# EAGLE schematic first (EAGLE 6.1)
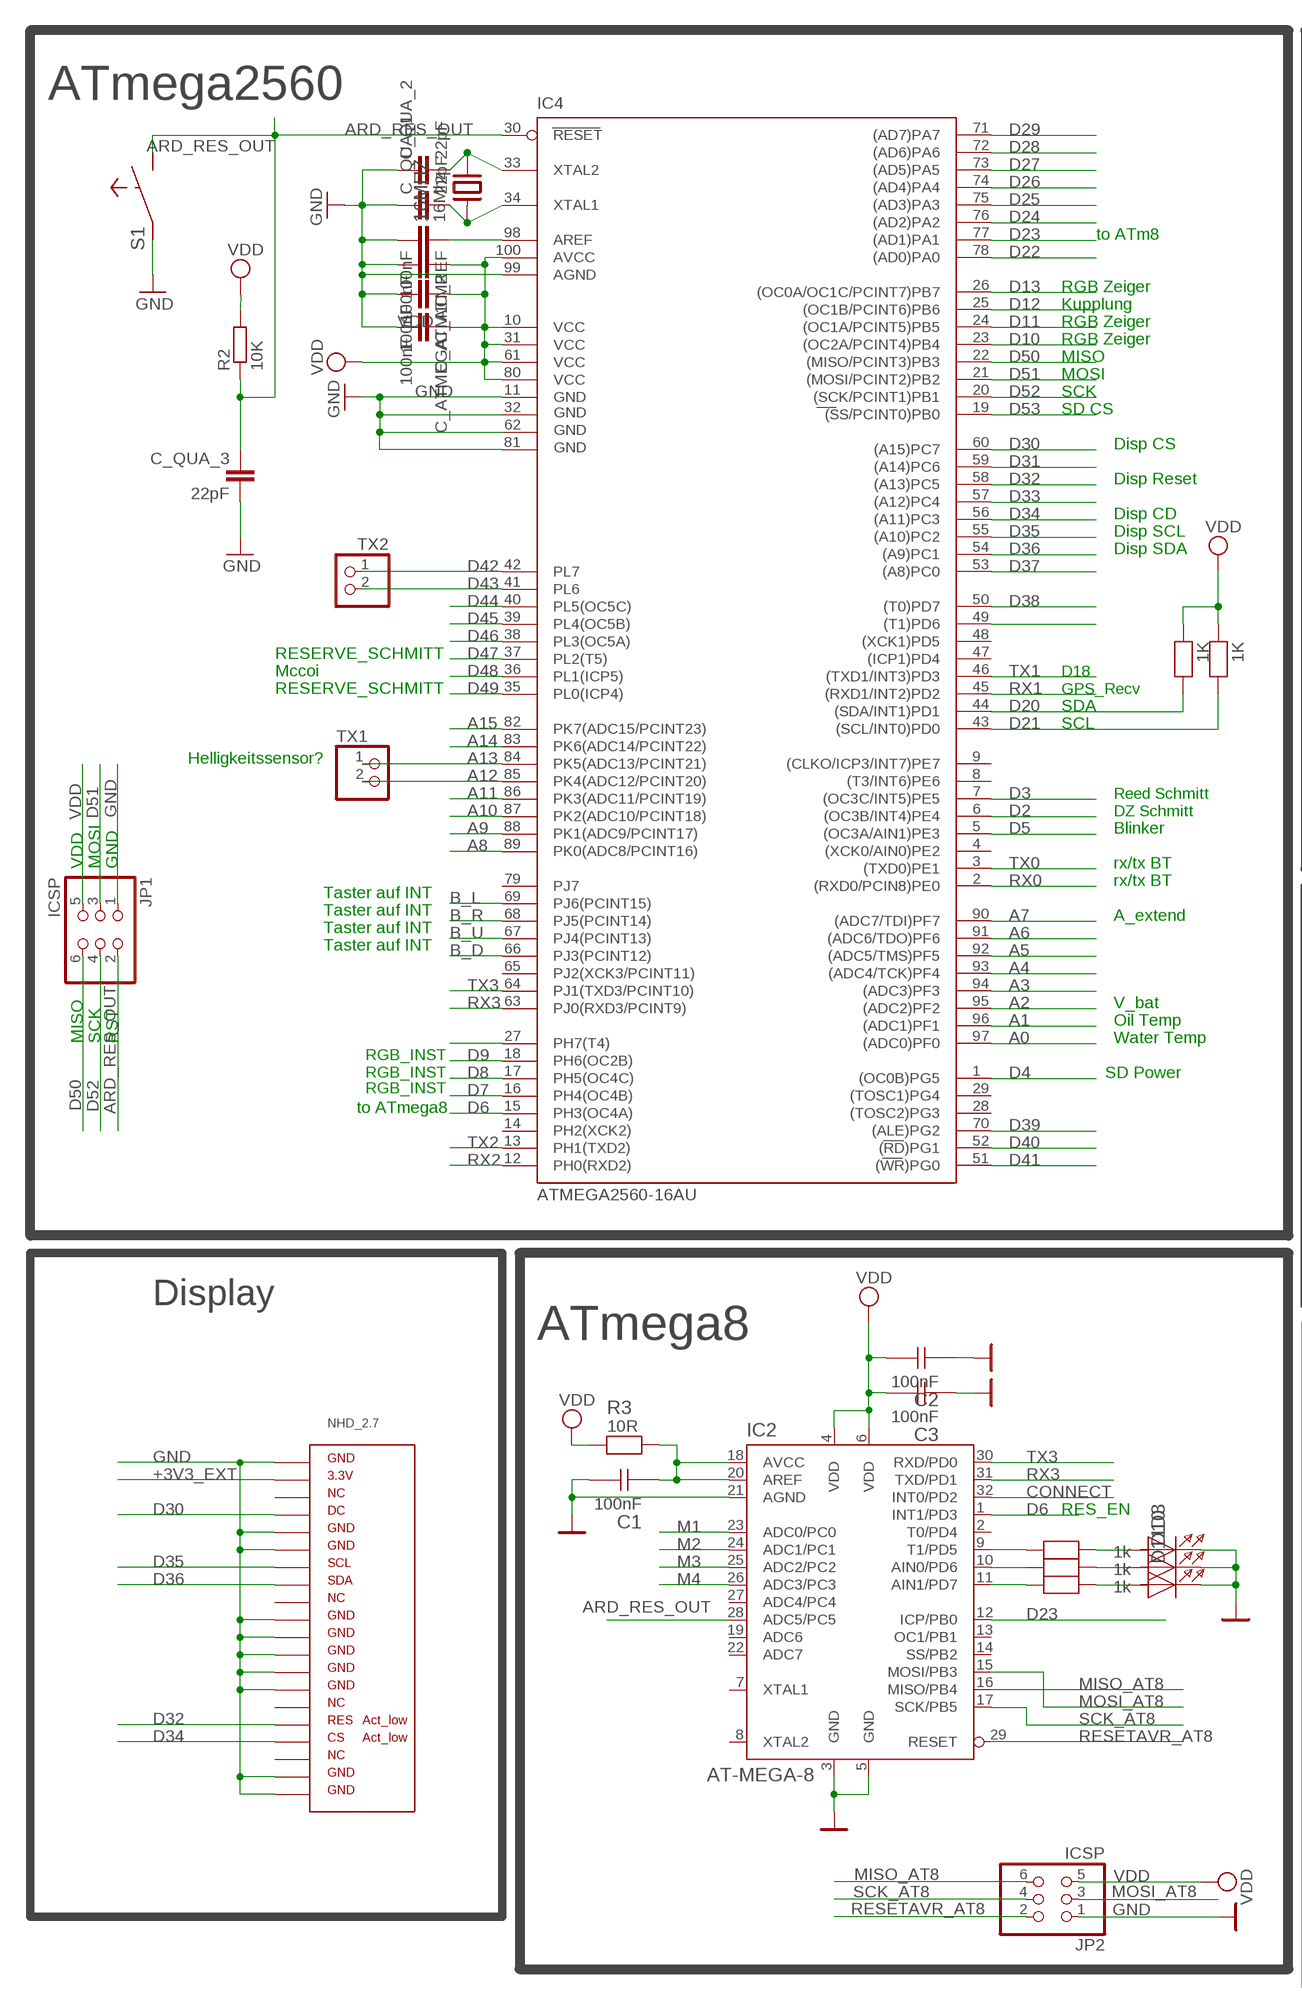
[diagram p0: schematic, sheet 1, part 1 of 2]
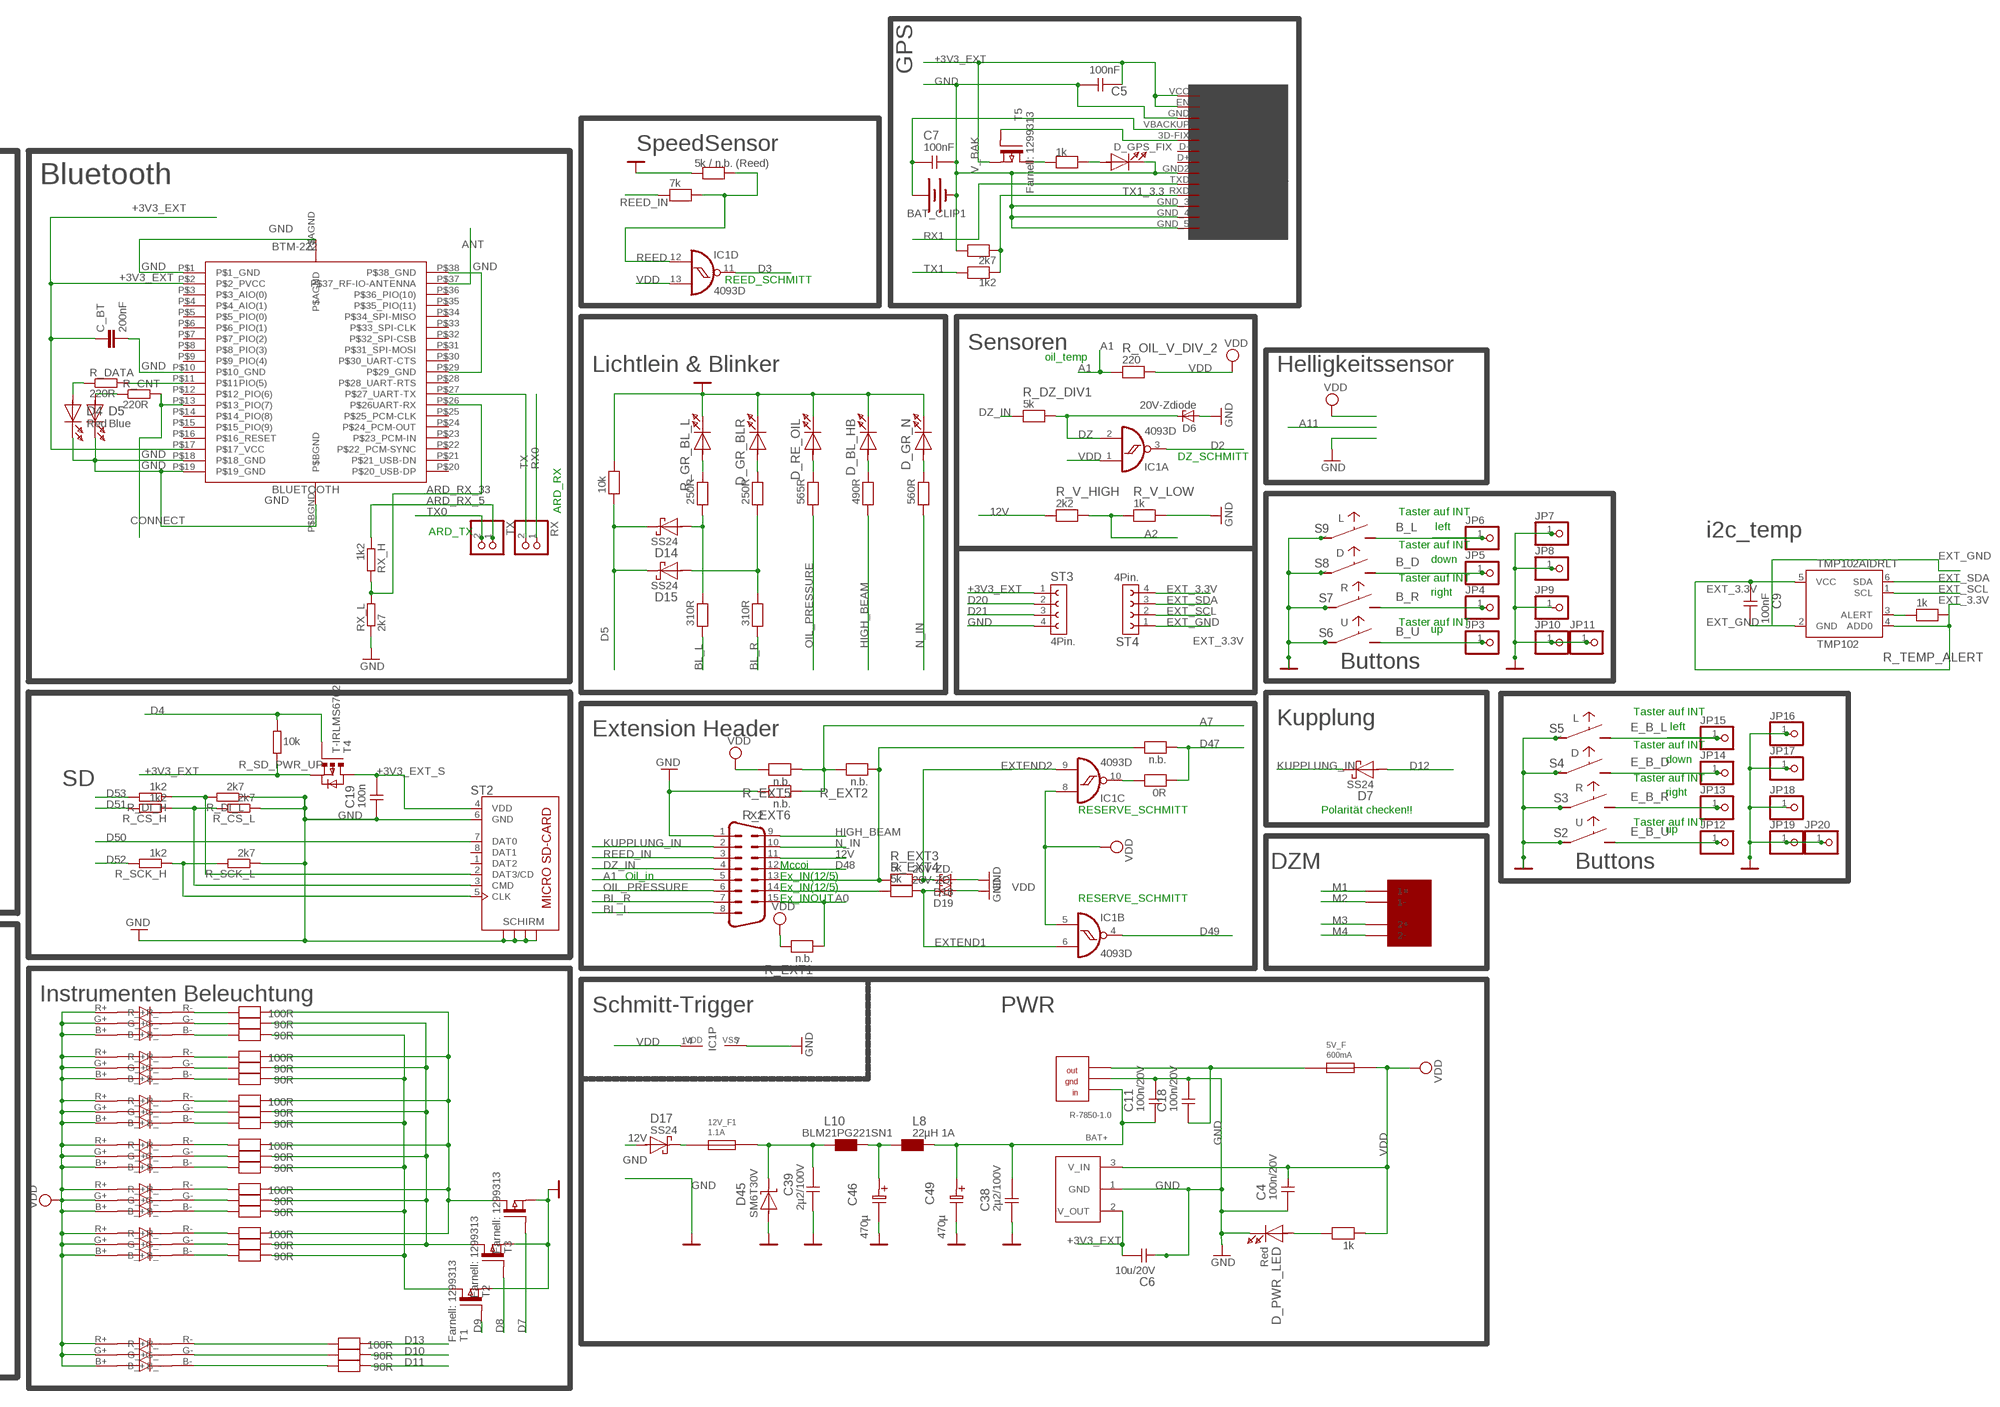
[diagram p1: schematic, sheet 1, part 2 of 2]

## Parts
5V_F  600mA  POLY_FUSE  [POLY_FUSE]
12V_F1  1.1A  POLY_FUSE  [POLY_FUSE]
16MHZ  16Mhz  XT-HC49-SMD  [XT-HC49S-SMD]
18632422  RGB_LED  [RGB_LED]
BAT_CLIP1  F_908642  BATTERY12MM  [BATTCON_12MM]
BLUETOOTH  BTM-222  [BTM-222]
C1  100nF  C0805  [0805]
C2  100nF  C0805  [0805]
C3  100nF  C0805  [0805]
C4  100n/20V  C0805  [0805]
C5  100nF  C0805  [0805]
C6  10u/20V  C0805  [0805]
C7  100nF  C0805  [0805]
C9  100nF  C0805  [0805]
C11  100n/20V  C0805  [0805]
C18  100n/20V  C0805  [0805]
C19  100n  C0805  [0805]
C38  2µ2/100V  C0805  [0805]
C39  2µ2/100V  C0805  [0805]
C46  470µ  C-ELKO-5-8X13R  [EL-5-8X13R]
C49  470µ  C-ELKO-5-8X13  [EL-5-8X13]
C_ATM1  100nF  C-EUC0805  [C0805]
C_ATM2  100nF  C-EUC0805  [C0805]
C_ATMEGA  100nF  C-EUC0805  [C0805]
C_BT  200nF  C-EUC0805  [C0805]
C_QUA_1  22pF  C-EUC0805  [C0805]
C_QUA_2  22pF  C-EUC0805  [C0805]
C_QUA_3  22pF  C-EUC0805  [C0805]
C_REF  100nF  C-EUC0805  [C0805]
D3  LED0805  [LED-0805]
D4  Red  LED0805  [LED-0805]
D5  Blue  LED0805  [LED-0805]
D6  20V-Zdiode  ZENER-DIODESMB  [SMB]
D7  SS24  D-SSMB-A+K  [SMB]
D10  LED0805  [LED-0805]
D11  LED0805  [LED-0805]
D14  SS24  D-SSMB-A+K  [SMB]
D15  SS24  D-SSMB-A+K  [SMB]
D17  SS24  D-SSMB-A+K  [SMB]
D18  20V-ZD.  ZENER-DIODESMB  [SMB]
D19  20V-ZD.  ZENER-DIODESMB  [SMB]
D45  SM6T30V  D-TD  [SMB]
D_BL_HB  HighB _ 645-598-8191-107F  LED0805  [LED-0805]
D_GPS_FIX  Red  LED0805  [LED-0805]
D_GR_BLR  BL_R  LED0805  [LED-0805]
D_GR_N  N _ M 645-598-8110-107F  LED0805  [LED-0805]
D_PWR_LED  Red  LED0805  [LED-0805]
D_RE_OIL  OIL M 645-598-8110-107F  LED0805  [LED-0805]
DCDC53.3  AP1117E33G  [SOT223]
GPS  MT3329  [MT3329]
IC1  4093D  [SO14]
IC2  AT-MEGA-8  [TQFP-32_7X7]
IC4  ATMEGA2560-16AU  [TQFP100]
JP1  ICSP  PINHD-2X3  [2X03]
JP2  ICSP  PINHD-2X3  [2X03]
JP3  PINHD-1X1  [1X01]
JP4  PINHD-1X1  [1X01]
JP5  PINHD-1X1  [1X01]
JP6  PINHD-1X1  [1X01]
JP7  PINHD-1X1  [1X01]
JP8  PINHD-1X1  [1X01]
JP9  PINHD-1X1  [1X01]
JP10  PINHD-1X1  [1X01]
JP11  PINHD-1X1  [1X01]
JP12  PINHD-1X1  [1X01]
JP13  PINHD-1X1  [1X01]
JP14  PINHD-1X1  [1X01]
JP15  PINHD-1X1  [1X01]
JP16  PINHD-1X1  [1X01]
JP17  PINHD-1X1  [1X01]
JP18  PINHD-1X1  [1X01]
JP19  PINHD-1X1  [1X01]
JP20  PINHD-1X1  [1X01]
L8  22µH 1A  LPD54  [L-PD54]
L10  BLM21PG221SN1  L0808+0603  [0805+603]
NHD_2.7  NHD_2.7_SOLO_RO  [NHD_2.7_SOLO_RO]
PWR_R78  R-7805-1.0  [SIP3]
R1  250R  R0805  [0805]
R2  10K  R-EU_R0805  [R0805]
R3  10R  R0805  [0805]
R4  250R  R0805  [0805]
R5  565R  R0805  [0805]
R6  490R  R0805  [0805]
R7  310R  R0805  [0805]
R8  310R  R0805  [0805]
R9  10k  R0805  [0805]
R10  5k / n.b. (Reed)  R0805  [0805]
R11  7k  R0805  [0805]
R12  100R  R0805  [0805]
R13  90R  R0805  [0805]
R14  90R  R0805  [0805]
R15  1k  R0805  [0805]
R16  1k  R0805  [0805]
R17  1k  R0805  [0805]
R18  100R  R0805  [0805]
R19  90R  R0805  [0805]
R20  90R  R0805  [0805]
R21  100R  R0805  [0805]
R22  90R  R0805  [0805]
R23  90R  R0805  [0805]
R24  100R  R0805  [0805]
R25  90R  R0805  [0805]
R26  90R  R0805  [0805]
R27  560R  R0805  [0805]
R28  1k  R0805  [0805]
R29  100R  R0805  [0805]
R30  90R  R0805  [0805]
R31  90R  R0805  [0805]
R32  100R  R0805  [0805]
R33  90R  R0805  [0805]
R34  90R  R0805  [0805]
R35  100R  R0805  [0805]
R36  90R  R0805  [0805]
R37  90R  R0805  [0805]
R38  0R  R0805  [0805]
R39  n.b.  R0805  [0805]
R40  2k7  R0805  [0805]
R41  1k2  R0805  [0805]
R_CNT  220R  R-EU_M0805  [M0805]
R_CS_H  1k2  R-EU_M0805  [M0805]
R_CS_L  2k7  R-EU_M0805  [M0805]
R_DATA  220R  R-EU_M0805  [M0805]
R_DI_H  1k2  R-EU_M0805  [M0805]
R_DI_L  2k7  R-EU_M0805  [M0805]
R_DZ_DIV1  5k  R0805  [0805]
R_EXT1  n.b.  R0805  [0805]
R_EXT2  n.b.  R0805  [0805]
R_EXT3  5k  R0805  [0805]
R_EXT4  5k  R0805  [0805]
R_EXT5  n.b.  R0805  [0805]
R_EXT6  n.b.  R0805  [0805]
R_GR_BL_L  BL_L  LED0805  [LED-0805]
R_LED_5V  1k  R0805  [0805]
R_OIL_V_DIV_2  220  R0805  [0805]
R_SCK_H  1k2  R-EU_M0805  [M0805]
R_SCK_L  2k7  R-EU_M0805  [M0805]
R_SCL_UP  1K  R0805  [0805]
R_SD_PWR_UP  10k  R-EU_M0805  [M0805]
R_SDA_UP  1K  R0805  [0805]
R_TEMP_ALERT  1k  R0805  [0805]
R_V_HIGH  2k2  R0805  [0805]
R_V_LOW  1k  R0805  [0805]
RX  PINHD-1X2  [1X02]
RX_H  1k2  R-EU_M0805  [M0805]
RX_L  2k7  R-EU_M0805  [M0805]
S1  SW-TASTERECO-DIAGONAL  [SW-ECO]
S2  U  SW-TASTERECO-DIAGONAL  [SW-ECO]
S3  R  SW-TASTERECO-DIAGONAL  [SW-ECO]
S4  D  SW-TASTERECO-DIAGONAL  [SW-ECO]
S5  L  SW-TASTERECO-DIAGONAL  [SW-ECO]
S6  U  SW-TASTERECO-DIAGONAL  [SW-ECO]
S7  R  SW-TASTERECO-DIAGONAL  [SW-ECO]
S8  D  SW-TASTERECO-DIAGONAL  [SW-ECO]
S9  L  SW-TASTERECO-DIAGONAL  [SW-ECO]
ST2  SD_MICRO  [SD_MICRO]
ST3  BU_1X4_BL17-SMD  [BL17SMD_1X4]
ST4  BU_1X4_BL17-SMD  [BL17SMD_1X4]
T1  Farnell: 1299313  T-P-FETBSS139  [SOT-23]
T2  Farnell: 1299313  T-P-FETBSS139  [SOT-23]
T3  Farnell: 1299313  T-P-FETBSS139  [SOT-23]
T4  T-IRLMS6702  [SOT-23-6]
T5  Farnell: 1299313  T-P-FETBSS139  [SOT-23]
TMP102AIDRLT  TMP102  [SOT563]
TX  PINHD-1X2  [1X02]
TX1  PINHD-1X2  [1X02]
TX2  PINHD-1X2  [1X02]
U$3  STEPPER  [STEPPER]
U$14  RGB_LED  [RGB_LED]
U$15  RGB_LED  [RGB_LED]
U$16  RGB_LED  [RGB_LED]
U$18  RGB_LED  [RGB_LED]
U$19  RGB_LED  [RGB_LED]
U$20  RGB_LED  [RGB_LED]
X2  SUB-D-IP67  [IP67-SUB-D]

## Nets
12V: D17.A R_V_HIGH.1 X2.11
12V_SAFE: 12V_F1.P$2 C39.1 D45.K L10.1
+3V3_EXT: BLUETOOTH.P$2(P$2_PVCC) BLUETOOTH.P$17(P$17_VCC) C5.2 C6.2 C_BT.1 DCDC53.3.2(V_OUT) GPS.EN GPS.VCC NHD_2.7.VDD0(VDD) R_SD_PWR_UP.2 ST3.1 T4.4(S) T5.2(S)
+3V3_EXT_S: C19.2 ST2.4(VDD) T4.1(D1) T4.2(D2) T4.5(D3) T4.6(D4)
A0: IC4.97((ADC0)PF0) R_EXT1.1 X2.15
A1: IC4.96((ADC1)PF1) R_OIL_V_DIV_2.1 X2.5
A2: IC4.95((ADC2)PF2) R_V_HIGH.2 R_V_LOW.1
A3: IC4.94((ADC3)PF3)
A4: IC4.93((ADC4/TCK)PF4)
A5: IC4.92((ADC5/TMS)PF5)
A6: IC4.91((ADC6/TDO)PF6)
A7: IC4.90((ADC7/TDI)PF7) R_EXT2.2 R_EXT5.1 R_EXT6.1
A8: IC4.89(PK0(ADC8/PCINT16))
A9: IC4.88(PK1(ADC9/PCINT17))
A10: IC4.87(PK2(ADC10/PCINT18))
A11: IC4.86(PK3(ADC11/PCINT19))
A12: IC4.85(PK4(ADC12/PCINT20)) TX1.2
A13: IC4.84(PK5(ADC13/PCINT21)) TX1.1
A14: IC4.83(PK6(ADC14/PCINT22))
A15: IC4.82(PK7(ADC15/PCINT23))
ANT: BLUETOOTH.P$37(P$37_RF-IO-ANTENNA)
ARD_RES_OUT: C_QUA_3.1 IC2.28(ADC5/PC5) IC4.30(RESET) JP1.2 R2.1 S1.4
ARD_RX_5: RX_H.1 TX.1
ARD_RX_33: BLUETOOTH.P$26(P$26UART-RX) RX_H.2 RX_L.2
B_D: IC4.66(PJ3(PCINT12)) JP5.1 S8.4
B_L: IC4.69(PJ6(PCINT15)) JP6.1 S9.4
B_R: IC4.68(PJ5(PCINT14)) JP4.1 S7.4
B_U: IC4.67(PJ4(PCINT13)) JP3.1 S6.4
BAT+: C11.1 C38.2 C49.1 L8.2 PWR_R78.IN
BL_L: R8.1 X2.8
BL_R: R7.1 X2.7
BLUE_INSTR: R14.2 R20.2 R23.2 R31.2 R34.2 R37.2 T1.3(D)
CONNECT: BLUETOOTH.P$13(P$13_PIO(7)) IC2.32(INT0/PD2) R_CNT.2
D2: IC1.3(A:O) IC4.6((OC3B/INT4)PE4)
D3: IC1.11(D:O) IC4.7((OC3C/INT5)PE5)
D4: IC4.1((OC0B)PG5) R_SD_PWR_UP.1 T4.3(G)
D5: D14.K D15.K IC4.5((OC3A/AIN1)PE3) R9.2
D6: IC2.1(INT1/PD3) IC4.15(PH3(OC4A))
D7: IC4.16(PH4(OC4B)) T3.1(G)
D8: IC4.17(PH5(OC4C)) T2.1(G)
D9: IC4.18(PH6(OC2B)) T1.1(G)
D10: IC4.23((OC2A/PCINT4)PB4) R25.2
D11: IC4.24((OC1A/PCINT5)PB5) R26.2
D12: D7.A IC4.25((OC1B/PCINT6)PB6)
D13: IC4.26((OC0A/OC1C/PCINT7)PB7) R24.2
D20: IC4.44((SDA/INT1)PD1) R_SDA_UP.2 ST3.2
D21: IC4.43((SCL/INT0)PD0) R_SCL_UP.2 ST3.3
D22: IC4.78((AD0)PA0)
D23: IC2.12(ICP/PB0) IC4.77((AD1)PA1)
D24: IC4.76((AD2)PA2)
D25: IC4.75((AD3)PA3)
D26: IC4.74((AD4)PA4)
D27: IC4.73((AD5)PA5)
D28: IC4.72((AD6)PA6)
D29: IC4.71((AD7)PA7)
D30: IC4.60((A15)PC7) NHD_2.7.DC
D31: IC4.59((A14)PC6)
D32: IC4.58((A13)PC5) NHD_2.7.RES
D33: IC4.57((A12)PC4)
D34: IC4.56((A11)PC3) NHD_2.7.CS
D35: IC4.55((A10)PC2) NHD_2.7.SCLK(SCL)
D36: IC4.54((A9)PC1) NHD_2.7.SDIN(SDA)
D37: IC4.53((A8)PC0)
D38: IC4.50((T0)PD7)
D39: IC4.70((ALE)PG2)
D40: IC4.52((RD)PG1)
D41: IC4.51((WR)PG0)
D42: IC4.42(PL7) TX2.1
D43: IC4.41(PL6) TX2.2
D44: IC4.40(PL5(OC5C))
D45: IC4.39(PL4(OC5B))
D46: IC4.38(PL3(OC5A))
D47: IC4.37(PL2(T5)) R38.2 R39.2
D48: IC4.36(PL1(ICP5)) X2.12
D49: IC1.4(B:O) IC4.35(PL0(ICP4))
D50: IC4.22((MISO/PCINT3)PB3) JP1.6 ST2.7(DAT0)
D51: IC4.21((MOSI/PCINT2)PB2) JP1.3 R_CS_H.2
D52: IC4.20((SCK/PCINT1)PB1) JP1.4 R_SCK_H.2
D53: IC4.19((SS/PCINT0)PB0) R_DI_H.2
DZ: D6.C IC1.2(A:I1) R_DZ_DIV1.2
DZ_IN: R_DZ_DIV1.1 X2.4
E_B_D: JP14.1 S4.4
E_B_L: JP15.1 S5.4
E_B_R: JP13.1 S3.4
E_B_U: JP12.1 S2.4
E_GND: JP16.1 JP17.1 JP18.1 JP19.1 JP20.1 S2.1 S3.1 S4.1 S5.1 ; supply symbol labelled GND
EXT_3.3V: C9.1 R_TEMP_ALERT.2 ST4.4 TMP102AIDRLT.4(ADD0) TMP102AIDRLT.5(VCC)
EXT_GND: C9.2 ST4.1 TMP102AIDRLT.2(GND)
EXT_SCL: ST4.2 TMP102AIDRLT.1(SCL)
EXT_SDA: ST4.3 TMP102AIDRLT.6(SDA)
EXTEND1: D19.C IC1.6(B:I1) R_EXT4.2
EXTEND2: D18.C IC1.9(C:I1) R_EXT3.2
GND: BAT_CLIP1.GND(-) BLUETOOTH.P$1(P$1_GND) BLUETOOTH.P$10(P$10_GND) BLUETOOTH.P$18(P$18_GND) BLUETOOTH.P$19(P$19_GND) BLUETOOTH.P$29(P$29_GND) BLUETOOTH.P$38(P$38_GND) BLUETOOTH.P$AGND BLUETOOTH.P$BGND C1.2 C2.1 C3.1 C4.1 C5.1 C6.1 C7.2 C11.2 C18.2 C19.1 C38.1 C39.2 C46.2 C49.2 C_ATM1.2 C_ATM2.2 C_ATMEGA.2 C_BT.2 C_QUA_1.1 C_QUA_2.1 C_QUA_3.2 C_REF.2 D3.2(K) D4.2(K) D5.2(K) D6.A D10.2(K) D11.2(K) D18.A D19.A D45.A D_BL_HB.2(K) D_GPS_FIX.2(K) D_GR_BLR.2(K) D_GR_N.2(K) D_PWR_LED.2(K) D_RE_OIL.2(K) DCDC53.3.1(GND) GPS.GND GPS.GND2 GPS.GND_3 GPS.GND_4 GPS.GND_5 IC1.7(P:VSS) IC2.3(GND) IC2.5(GND) IC2.21(AGND) IC4.11(GND) IC4.32(GND1) IC4.62(GND2) IC4.81(GND3) IC4.99(AGND) JP1.1 JP2.1 JP7.1 JP8.1 JP9.1 JP10.1 JP11.1 NHD_2.7.GND0(GND) NHD_2.7.GND1(GND2) NHD_2.7.GND2(GND3) NHD_2.7.GND3(GND4) NHD_2.7.GND4(GND5) NHD_2.7.GND5(GND6) NHD_2.7.GND6(GND7) NHD_2.7.GND7(GND8) NHD_2.7.GND8(GND9) NHD_2.7.GND9(GND10) PWR_R78.GND R9.1 R10.2 R40.2 R_CS_L.1 R_DI_L.1 R_EXT6.2 R_GR_BL_L.2(K) R_SCK_L.1 R_V_LOW.2 RX_L.1 S1.1 S6.1 S7.1 S8.1 S9.1 ST2.6(GND) ST2.GND2(SCHIRM2) ST2.GND3(SCHIRM3) ST2.GND4(SCHIRM) ST2.GND(SCHIRM1) ST3.4 T1.2(S) T2.2(S) T3.2(S) X2.1
GREEN_INSTR: R13.2 R19.2 R22.2 R30.2 R33.2 R36.2 T2.3(D)
HIGH_BEAM: R6.1 X2.9
KUPPLUNG_IN: D7.K X2.2
M1: IC2.23(ADC0/PC0) U$3.1+
M2: IC2.24(ADC1/PC1) U$3.1-
M3: IC2.25(ADC2/PC2) U$3.2+
M4: IC2.26(ADC3/PC3) U$3.2-
MISO_AT8: IC2.16(MISO/PB4) JP2.6
MOSI_AT8: IC2.15(MOSI/PB3) JP2.3
N$1: C46.1 L8.1 L10.2
N$2: D14.A R1.1 R8.2
N$3: C1.1 IC2.18(AVCC) IC2.20(AREF) R3.2
N$4: R_TEMP_ALERT.1 TMP102AIDRLT.3(ALERT)
N$5: D5.1(A) R_CNT.1
N$6: R31.1 U$18.B-(B_-)
N$7: R30.1 U$18.G-(G_-)
N$8: R29.1 U$18.R-(R_-)
N$9: D_PWR_LED.1(A) R_LED_5V.2
N$10: R34.1 U$16.B-(B_-)
N$11: D15.A R4.1 R7.2
N$12: D4.1(A) R_DATA.1
N$13: R_CS_H.1 R_CS_L.2 ST2.3(CMD)
N$14: IC2.11(AIN1/PD7) R17.1
N$15: D_GPS_FIX.1(A) R28.2
N$16: GPS.3D-FIX T5.1(G)
N$17: R28.1 T5.3(D)
N$18: IC2.10(AIN0/PD6) R16.1
N$19: 5V_F.P$1 C18.1 PWR_R78.OUT
N$20: IC2.9(T1/PD5) R15.1
N$21: R33.1 U$16.G-(G_-)
N$22: R32.1 U$16.R-(R_-)
N$23: R_SCK_H.1 R_SCK_L.2 ST2.5(CLK)
N$24: 12V_F1.P$1 D17.K
N$26: R_DI_H.1 R_DI_L.2 ST2.2(DAT3/CD)
N$27: R37.1 U$14.B-(B_-)
N$29: IC4.49((T1)PD6)
N$30: R36.1 U$14.G-(G_-)
N$31: IC4.27(PH7(T4))
N$32: R35.1 U$14.R-(R_-)
N$33: R1.2 R_GR_BL_L.1(A)
N$34: D_GR_BLR.1(A) R4.2
N$35: 16MHZ.2 C_QUA_2.2 IC4.33(XTAL2)
N$36: 16MHZ.1 C_QUA_1.2 IC4.34(XTAL1)
N$37: C_REF.1 IC4.98(AREF)
N$38: D_RE_OIL.1(A) R5.2
N$39: D_BL_HB.1(A) R6.2
N$40: IC1.10(C:O) R38.1
N$51: R12.1 U$15.R-(R_-)
N$52: R13.1 U$15.G-(G_-)
N$53: R14.1 U$15.B-(B_-)
N$54: 18632422.R-(R_-) R18.1
N$55: 18632422.G-(G_-) R19.1
N$56: 18632422.B-(B_-) R20.1
N$57: R21.1 U$19.R-(R_-)
N$58: R22.1 U$19.G-(G_-)
N$59: R23.1 U$19.B-(B_-)
N$63: R24.1 U$20.R-(R_-)
N$64: R25.1 U$20.G-(G_-)
N$65: R26.1 U$20.B-(B_-)
N$69: D_GR_N.1(A) R27.2
N$78: R_EXT4.1 X2.14
N$79: R39.1 R_EXT2.1 R_EXT3.1 X2.13
N_IN: R27.1 X2.10
OIL_PRESSURE: R5.1 X2.6
P0: D3.1(A) R15.2
P1: D10.1(A) R16.2
P2: D11.1(A) R17.2
RED_INSTR: R12.2 R18.2 R21.2 R29.2 R32.2 R35.2 T3.3(D)
REED: IC1.12(D:I0) R10.1 R11.2
REED_IN: R11.1 X2.3
RESETAVR_AT8: IC2.29(RESET) JP2.2
RX0: IC4.2((RXD0/PCIN8)PE0) RX.1
RX1: GPS.TXD(TXD_NMEA_OUT) IC4.45((RXD1/INT2)PD2)
RX2: IC4.12(PH0(RXD2))
RX3: IC2.31(TXD/PD1) IC4.63(PJ0(RXD3/PCINT9))
SCK_AT8: IC2.17(SCK/PB5) JP2.4
TO_DATA_LED: BLUETOOTH.P$11(P$11PIO(5)) R_DATA.2
TX: BLUETOOTH.P$27(P$27_UART-TX) RX.2
TX0: IC4.3((TXD0)PE1) TX.2
TX1: IC4.46((TXD1/INT3)PD3) R41.2
TX1_3.3: GPS.RXD R40.1 R41.1
TX2: IC4.13(PH1(TXD2))
TX3: IC2.30(RXD/PD0) IC4.64(PJ1(TXD3/PCINT10))
V_BAK: BAT_CLIP1.PWR@1(+) C7.1 GPS.VBACKUP
VDD: 5V_F.P$2 18632422.B+(B_+) 18632422.G+(G_+) 18632422.R+(R_+) C2.2 C3.2 C4.2 C_ATM1.1 C_ATM2.1 C_ATMEGA.1 DCDC53.3.3(V_IN) IC1.1(A:I0) IC1.5(B:I0) IC1.8(C:I0) IC1.13(D:I1) IC1.14(P:VDD) IC2.4(VDD) IC2.6(VDD) IC4.10(VCC) IC4.31(VCC1) IC4.61(VCC2) IC4.80(VCC3) IC4.100(AVCC) JP1.5 JP2.5 R2.2 R3.1 R_EXT1.2 R_EXT5.2 R_LED_5V.1 R_OIL_V_DIV_2.2 R_SCL_UP.1 R_SDA_UP.1 U$14.B+(B_+) U$14.G+(G_+) U$14.R+(R_+) U$15.B+(B_+) U$15.G+(G_+) U$15.R+(R_+) U$16.B+(B_+) U$16.G+(G_+) U$16.R+(R_+) U$18.B+(B_+) U$18.G+(G_+) U$18.R+(R_+) U$19.B+(B_+) U$19.G+(G_+) U$19.R+(R_+) U$20.B+(B_+) U$20.G+(G_+) U$20.R+(R_+)
Unconnected: BLUETOOTH.P$3(P$3_AIO(0)) BLUETOOTH.P$4(P$4_AIO(1)) BLUETOOTH.P$5(P$5_PIO(0)) BLUETOOTH.P$6(P$6_PIO(1)) BLUETOOTH.P$7(P$7_PIO(2)) BLUETOOTH.P$8(P$8_PIO(3)) BLUETOOTH.P$9(P$9_PIO(4)) BLUETOOTH.P$12(P$12_PIO(6)) BLUETOOTH.P$14(P$14_PIO(8)) BLUETOOTH.P$15(P$15_PIO(9)) BLUETOOTH.P$16(P$16_RESET) BLUETOOTH.P$20(P$20_USB-DP) BLUETOOTH.P$21(P$21_USB-DN) BLUETOOTH.P$22(P$22_PCM-SYNC) BLUETOOTH.P$23(P$23_PCM-IN) BLUETOOTH.P$24(P$24_PCM-OUT) BLUETOOTH.P$25(P$25_PCM-CLK) BLUETOOTH.P$28(P$28_UART-RTS) BLUETOOTH.P$30(P$30_UART-CTS) BLUETOOTH.P$31(P$31_SPI-MOSI) BLUETOOTH.P$32(P$32_SPI-CSB) BLUETOOTH.P$33(P$33_SPI-CLK) BLUETOOTH.P$34(P$34_SPI-MISO) BLUETOOTH.P$35(P$35_PIO(11)) BLUETOOTH.P$36(P$36_PIO(10)) GPS.D+(DMINUS) GPS.D-(DPLUS) IC2.2(T0/PD4) IC2.7(XTAL1) IC2.8(XTAL2) IC2.13(OC1/PB1) IC2.14(SS/PB2) IC2.19(ADC6) IC2.22(ADC7) IC2.27(ADC4/PC4) IC4.4((XCK0/AIN0)PE2) IC4.8((T3/INT6)PE6) IC4.9((CLKO/ICP3/INT7)PE7) IC4.14(PH2(XCK2)) IC4.28((TOSC2)PG3) IC4.29((TOSC1)PG4) IC4.47((ICP1)PD4) IC4.48((XCK1)PD5) IC4.65(PJ2(XCK3/PCINT11)) IC4.79(PJ7) NHD_2.7.NC0(NC) NHD_2.7.NC1(NC2) NHD_2.7.NC2(NC3) NHD_2.7.NC3(NC4) ST2.1(DAT2) ST2.8(DAT1)

## Notes on the sheet
- GPS
- SpeedSensor
- Bluetooth
- ATmega2560
- to ATm8 | REED_SCHMITT
- RGB Zeiger
- Kupplung
- RGB Zeiger
- RGB Zeiger | Sensoren
- MISO | oil_temp
- MOSI | Lichtlein & Blinker | Helligkeitssensor
- SCK
- SD CS
- Disp CS
- Disp Reset
- Disp CD | DZ_SCHMITT
- Disp SCL
- Disp SDA
- ARD_RX | Taster auf INT
- left
- ARD_TX | i2c_temp
- RESERVE_SCHMITT | Taster auf INT
- Mccoi | D18
- down
- RESERVE_SCHMITT | GPS_Recv
- SDA | Taster auf INT
- SCL
- right
- Helligkeitssensor?
- Taster auf INT
- up
- Reed Schmitt
- DZ Schmitt
- Blinker
- Buttons
- VDD | MOSI | GND | rx/tx BT
- Taster auf INT | rx/tx BT
- Taster auf INT
- Taster auf INT | A_extend | Taster auf INT
- Taster auf INT | Kupplung
- left
- Extension Header
- Taster auf INT
- down
- V_bat
- Oil Temp | Taster auf INT
- SD
- MISO | SCK | RST | Water Temp
- RGB_INST | right
- RGB_INST
- RGB_INST | SD Power | RESERVE_SCHMITT | Polarität checken!!
- to ATmega8 | Taster auf INT
- up
- Mccoi | DZM | Buttons
- Oil_in | Ex_IN(12/5)
- Ex_IN(12/5)
- Ex_INOUT | RESERVE_SCHMITT
- Display
- ATmega8
- Instrumenten Beleuchtung
- Schmitt-Trigger | PWR
- RES_EN

## Library data of the parts
5V_F 12V_F1 = Kolja:POLY_FUSE
16MHZ = XT:XT: Datenblatt von Citizen: http://www.citizencrystal.com/images/pdf/k-cm315.pdf
18632422 U$14-U$16 U$18-U$20 = Kolja:RGB_LED: 1863244 Farnell ~ 0,9?
BAT_CLIP1 = SparkFun:BATTERY: Battery Holders Various common sizes : AA, AAA, 20mm coin cell and 12mm coin cell.
BLUETOOTH = btm-222:BTM-222: Rayson BTM-222 Bluetooth Modul all Pins
C1-C7 C9 C11 C18 C19 C38 C39 = RCLDT:C
C46 C49 = RCLDT:C-ELKO
C_ATM1 C_ATM2 C_ATMEGA C_BT C_QUA_1-C_QUA_3 C_REF = rcl:C-EU: CAPACITOR, European symbol
D3-D5 D10 D11 D_BL_HB D_GPS_FIX D_GR_BLR D_GR_N D_PWR_LED D_RE_OIL R_GR_BL_L = OPTO:LED
D6 D18 D19 = diode:ZENER-DIODE: Z-Diode
D7 D14 D15 D17 = RCLDT:D-S
D45 = RCLDT:D-TD
DCDC53.3 = Kolja:AP1117E33G
GPS = Kolja:MT3329
IC1 = 40xx:4093: Quad 2-input NAND schmitt trigger
IC2 = µP´s+Pic´s:AT-MEGA-8
IC4 = atmel-2005:ATMEGA*: MICROCONTROLLER 64/128/256 Kbytes FLASH 4 Kbytes EEPROM 8 Kbytes SRAM 86 General Purpose I/O pins 12-channels16-bit PWM 4 x Serial USARTs 16-channels 10-bit A/D
JP1 JP2 = pinhead:PINHD-2X3: PIN HEADER
JP3-JP20 = pinhead:PINHD-1X1: PIN HEADER
L8 L10 = RCLDT:L
NHD_2.7 = Kolja:NHD_2.7_SOLO_RO
PWR_R78 = Kolja:R-7805-1.0
R1 R3-R41 R_DZ_DIV1 R_EXT1-R_EXT6 R_LED_5V R_OIL_V_DIV_2 R_SCL_UP R_SDA_UP R_TEMP_ALERT R_V_HIGH R_V_LOW = RCLDT:R
R2 R_CNT R_DATA = rcl:R-EU_: RESISTOR, European symbol
R_CS_H R_CS_L R_DI_H R_DI_L R_SCK_H R_SCK_L R_SD_PWR_UP RX_H RX_L = resistor:R-EU_: RESISTOR, European symbol
RX TX TX1 TX2 = pinhead:PINHD-1X2: PIN HEADER
S1-S9 = SWITCH+RELAIS:SW-TASTER
ST2 = Kolja:SD_MICRO
ST3 ST4 = Stift+Buchsenleisten:BU_1X4: Buchsenleiste; ARTIKELNUMMER: 151469; BESONDERHEITEN: Teilstück von 10pol. Buchsenleiste; HERSTELLER: Fischer BL17/SMD-10/Z (lose), MPE BL SMD 30-010 C/TRU(reel); PACKAGE: SMD liegend L=7mm; RM: 2,54; STROM: 3A; WERT: 4Pin.
T1-T3 T5 = RCLDT:T-P-FET
T4 = RCLDT:T-IRLMS6702
TMP102AIDRLT = SparkFun:TMP102
U$3 = Kolja:STEPPER
X2 = Kolja2:SUB-D-IP67

## Net classes
0 default: width 0.18 mm, drill 0.3 mm, clearance 0.15 mm